# EAGLE schematic twip-sb2 (EAGLE 9.2.1)
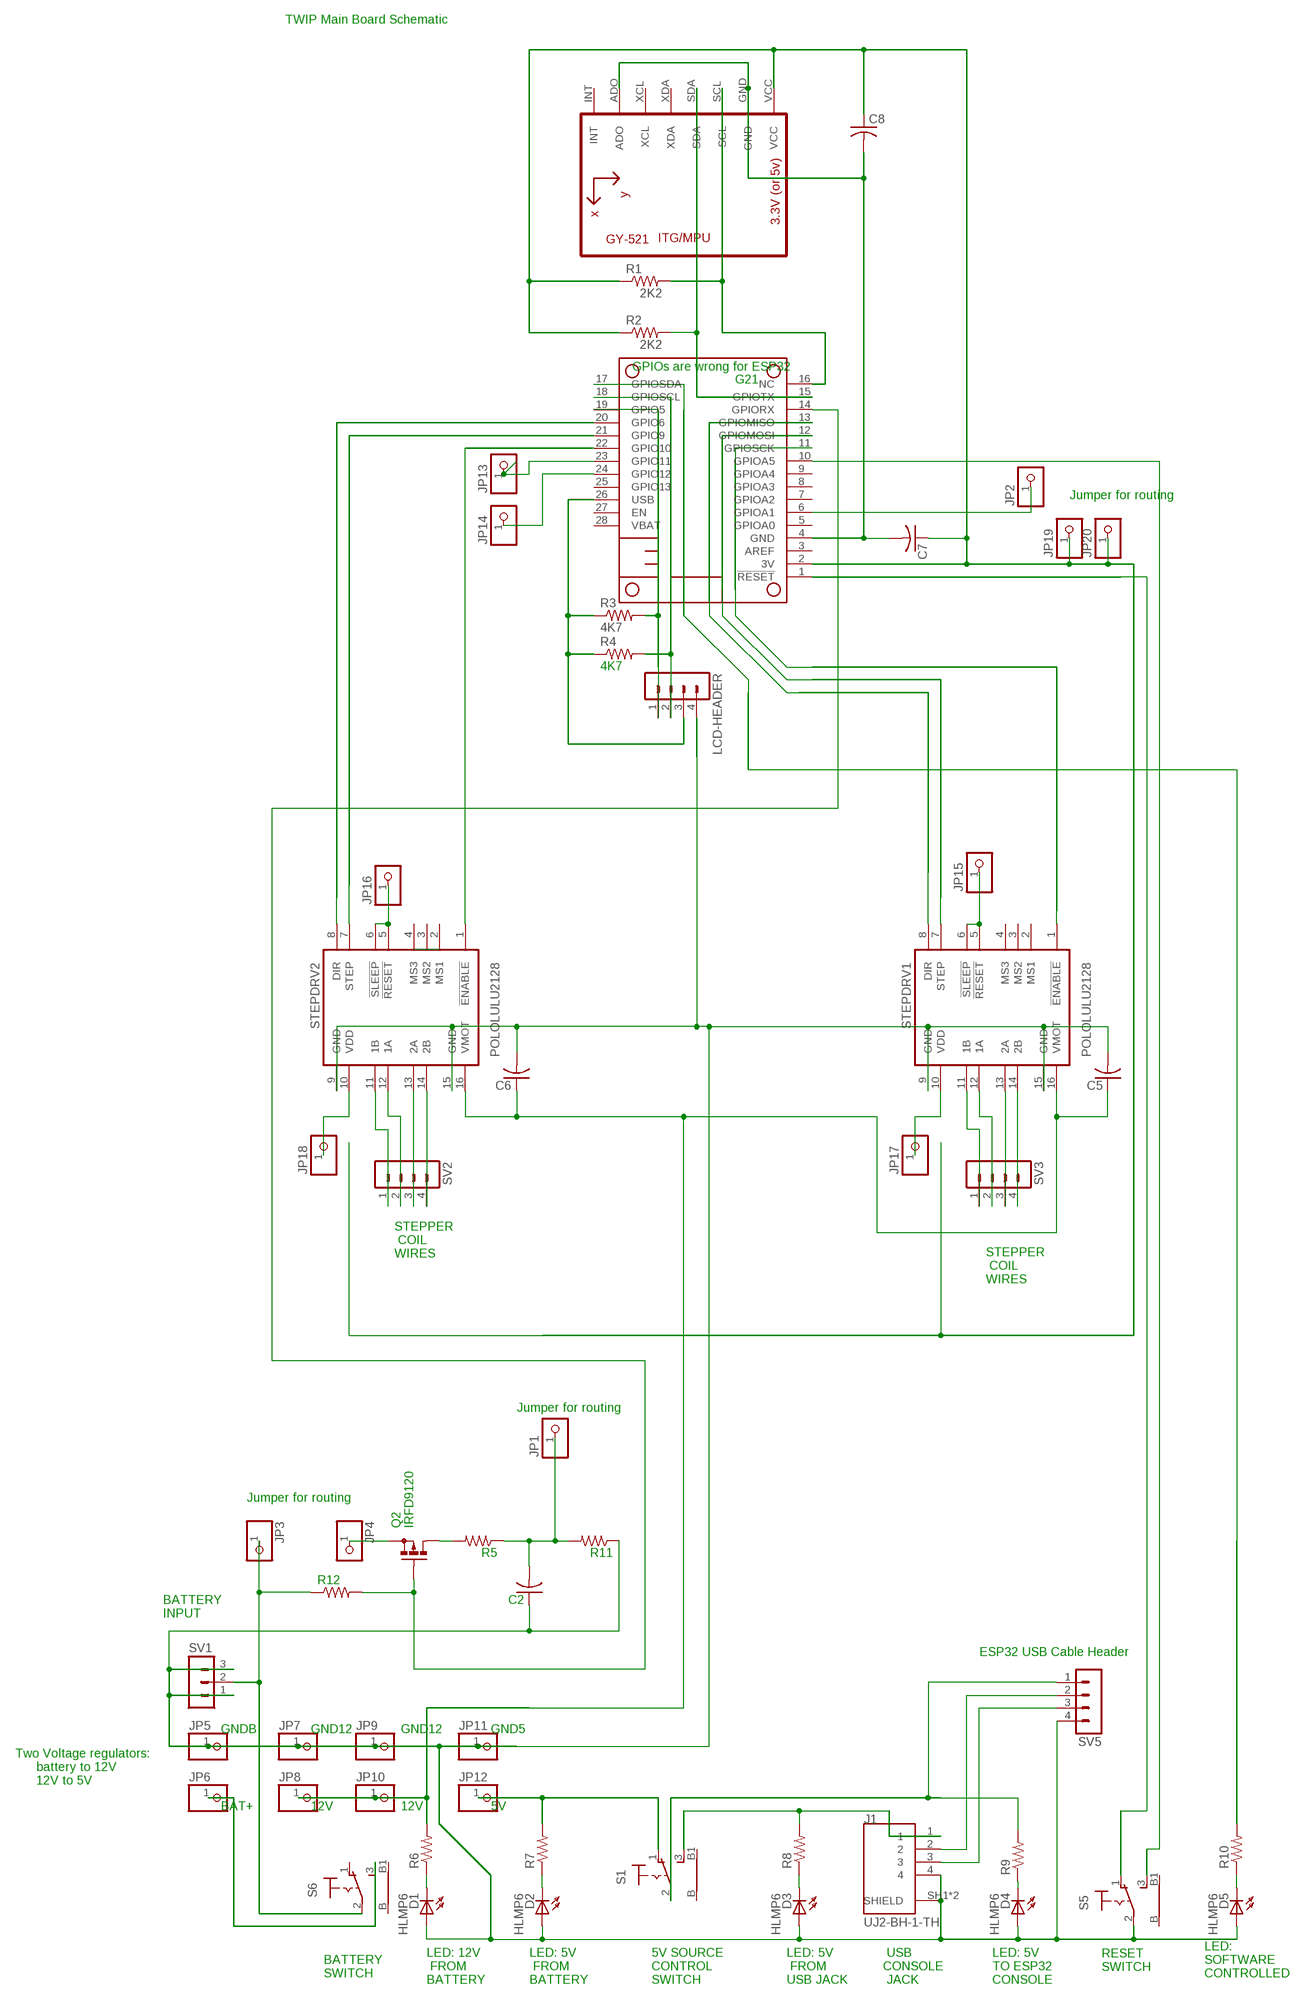
[diagram p0: schematic, sheet 1]

## Parts
C2  C-US050-025X075  [C050-025X075]
C5  C-US050-024X044  [C050-024X044]
C6  C-US050-024X044  [C050-024X044]
C7  C-US050-024X044  [C050-024X044]
C8  C-US050-024X044  [C050-024X044]
D1  HLMP6  [HLMP6]
D2  HLMP6  [HLMP6]
D3  HLMP6  [HLMP6]
D4  HLMP6  [HLMP6]
D5  HLMP6  [HLMP6]
J1  UJ2-BH-1-TH  [CUI_UJ2-BH-1-TH]
JP1  PINHD-1X1  [1X01]
JP2  PINHD-1X1  [1X01]
JP3  PINHD-1X1  [1X01]
JP4  PINHD-1X1  [1X01]
JP5  PINHD-1X1  [1X01]
JP6  PINHD-1X1  [1X01]
JP7  PINHD-1X1  [1X01]
JP8  PINHD-1X1  [1X01]
JP9  PINHD-1X1  [1X01]
JP10  PINHD-1X1  [1X01]
JP11  PINHD-1X1  [1X01]
JP12  PINHD-1X1  [1X01]
JP13  PINHD-1X1  [1X01]
JP14  PINHD-1X1  [1X01]
JP15  PINHD-1X1  [1X01]
JP16  PINHD-1X1  [1X01]
JP17  PINHD-1X1  [1X01]
JP18  PINHD-1X1  [1X01]
JP19  PINHD-1X1  [1X01]
JP20  PINHD-1X1  [1X01]
LCD-HEADER  MA04-1  [MA04-1]
MS2  FEATHERWING_NOHOLES  [FEATHERWING_NOHOLES]
Q2  IRFD9120  [C370-01]
R1  2K2  R-US_0309/12  [0309/12]
R2  2K2  R-US_0309/12  [0309/12]
R3  4K7  R-US_0309/12  [0309/12]
R4  4K7  R-US_0309/12  [0309/12]
R5  R-US_0207/10  [0207/10]
R6  R-US_0207/10  [0207/10]
R7  R-US_0207/10  [0207/10]
R8  R-US_0207/10  [0207/10]
R9  R-US_0207/10  [0207/10]
R10  R-US_0207/10  [0207/10]
R11  R-US_0207/10  [0207/10]
R12  R-US_0207/10  [0207/10]
S1  9070-1W  [9070-1W]
S5  9070-1W  [9070-1W]
S6  9070-1W  [9070-1W]
STEPDRV1  POLOLULU2128  [POLOLULU2128]
STEPDRV2  POLOLULU2128  [POLOLULU2128]
SV1  MA03-1  [MA03-1]
SV2  MA04-1  [MA04-1]
SV3  MA04-1  [MA04-1]
SV5  MA04-1  [MA04-1]
U1  GY-521MPU6050  [GY-521]

## Nets
3V: C7.1 C8.1 JP19.1 JP20.1 MS2.2(3V) R1.1 R2.1 U1.VCC
N$2: C7.2 C8.2 MS2.4(GND) U1.ADO U1.GND
N$3: MS2.13(GPIOMISO) STEPDRV1.8(DIR)
N$4: MS2.1(!RESET) S5.1(O)
N$5: JP15.1 STEPDRV1.5(!RESET) STEPDRV1.6(!SLEEP)
N$6: MS2.14(GPIORX) Q2.G R12.2
N$7: JP16.1 STEPDRV2.5(!RESET) STEPDRV2.6(!SLEEP)
N$8: STEPDRV2.14(2B) SV2.4
N$9: C2.1 C5.2 C6.2 D1.A D2.A D3.A D4.A D5.A J1.4 J1.SH1(SHIELD) J1.SH2(SHIELD) JP5.1 JP7.1 JP9.1 JP11.1 LCD-HEADER.4 R11.1 S5.2(P) STEPDRV1.9(GND) STEPDRV1.15(GND) STEPDRV2.9(GND) STEPDRV2.15(GND) SV1.1 SV1.3 SV5.4
N$11: LCD-HEADER.1 MS2.19(GPIO5) R3.2
N$12: STEPDRV2.13(2A) SV2.3
N$13: STEPDRV2.12(1A) SV2.2
N$14: STEPDRV2.11(1B) SV2.1
N$15: MS2.12(GPIOMOSI) STEPDRV1.7(STEP)
N$16: STEPDRV1.14(2B) SV3.4
N$17: MS2.16(NC) R1.2 U1.SCL
N$18: STEPDRV1.13(2A) SV3.3
N$19: STEPDRV1.12(1A) SV3.2
N$20: STEPDRV1.11(1B) SV3.1
N$21: MS2.11(GPIOSCK) STEPDRV1.1(!ENABLE)
N$22: J1.2 SV5.2
N$23: J1.3 SV5.3
N$24: JP4.1 Q2.S
N$25: MS2.15(GPIOTX) R2.2 U1.SDA
N$27: MS2.20(GPIO6) STEPDRV2.8(DIR)
N$28: MS2.17(GPIOSDA) R10.2
N$29: MS2.21(GPIO9) STEPDRV2.7(STEP)
N$30: C2.2 JP1.1 R5.1 R11.2
N$31: MS2.10(GPIOA5) S5.3(S)
N$32: JP3.1 R12.1 S6.2(P) SV1.2
N$33: JP2.1 MS2.6(GPIOA1)
N$34: MS2.22(GPIO10) STEPDRV2.1(!ENABLE)
N$35: LCD-HEADER.2 MS2.18(GPIOSCL) R4.2
N$36: JP13.1 MS2.23(GPIO11)
N$37: JP14.1 MS2.24(GPIO12)
N$38: JP18.1 STEPDRV2.10(VDD)
N$39: JP17.1 STEPDRV1.10(VDD)
N$40: JP6.1 S6.3(S)
N$41: C5.1 C6.1 JP8.1 JP10.1 R6.2 STEPDRV1.16(VMOT) STEPDRV2.16(VMOT)
N$45: JP12.1 R7.2 S1.1(O)
N$48: R9.2 S1.2(P) SV5.1
N$51: Q2.D Q2.D1(D) R5.2
N$52: D4.K R9.1
N$53: D1.K R6.1
N$54: D2.K R7.1
N$55: D3.K R8.1
N$56: J1.1 R8.2 S1.3(S)
N$57: D5.K R10.1
USB: LCD-HEADER.3 MS2.26(USB) R3.1 R4.1
Unconnected: MS2.3(AREF) MS2.5(GPIOA0) MS2.7(GPIOA2) MS2.8(GPIOA3) MS2.9(GPIOA4) MS2.25(GPIO13) MS2.27(EN) MS2.28(VBAT) S1.B S1.B1 S5.B S5.B1 S6.1(O) S6.B S6.B1 STEPDRV1.2(MS1) STEPDRV1.3(MS2) STEPDRV1.4(MS3) STEPDRV2.2(MS1) STEPDRV2.3(MS2) STEPDRV2.4(MS3) U1.INT U1.XCL U1.XDA

## Notes on the sheet
- TWIP Main Board Schematic
- GPIOs are wrong for ESP32
- G21
- Jumper for routing
- STEPPER
   COIL
  WIRES
- STEPPER
   COIL
  WIRES
- Jumper for routing
- Jumper for routing
- BATTERY
  INPUT
- ESP32 USB Cable Header
- GNDB | GND12 | GND12 | GND5
- Two Voltage regulators:
        battery to 12V
        12V to 5V
- BAT+ | 12V | 12V | 5V
- RESET
  SWITCH
- BATTERY 
  SWITCH
- LED: 
  SOFTWARE
  CONTROLLED
- LED: 12V
   FROM
  BATTERY
- LED: 5V
   FROM
  BATTERY
- 5V SOURCE
  CONTROL
  SWITCH
- LED: 5V
   FROM
  USB JACK
- USB
  CONSOLE
   JACK
- LED: 5V
  TO ESP32
  CONSOLE

## Library data of the parts
C2 C5-C8 = rcl:C-US: CAPACITOR, American symbol; SPICEPREFIX: C
D1-D5 = display-hp:HLMP6: LED 2mm horizontal; MF: AGILENT TECHNOLOGIES; MPN: HLMP-6500; OC_FARNELL: 1652490; OC_NEWARK: 40K0088
J1 = UJ2-BH-1-TH:UJ2-BH-1-TH: 3 µin Plating Thickness, Black Insulator, USB Receptacle; MANUFACTURER: CUI INC; PART_REV: 1.0; STANDARD: MANUFACTURER RECOMENDATION
JP1-JP20 = pinhead:PINHD-1X1: PIN HEADER
LCD-HEADER SV2 SV3 SV5 = con-lstb:MA04-1: PIN HEADER; OC_FARNELL: unknown; OC_NEWARK: unknown
MS2 = microbuilder:FEATHERWING
Q2 = transistor-small-signal:IRFD9120: P-CHANNEL MOS FET
R1-R4 = resistor:R-US_: RESISTOR, American symbol
R5-R12 = rcl:R-US_: RESISTOR, American symbol; SPICEPREFIX: R
S1 S5 S6 = switch:9070-1W: TOGGLE SWITCH Marquardt
STEPDRV1 STEPDRV2 = stepper_drivers_etc:POLOLULU2128
SV1 = con-lstb:MA03-1: PIN HEADER; OC_FARNELL: unknown; OC_NEWARK: unknown
U1 = gy-521:GY-521